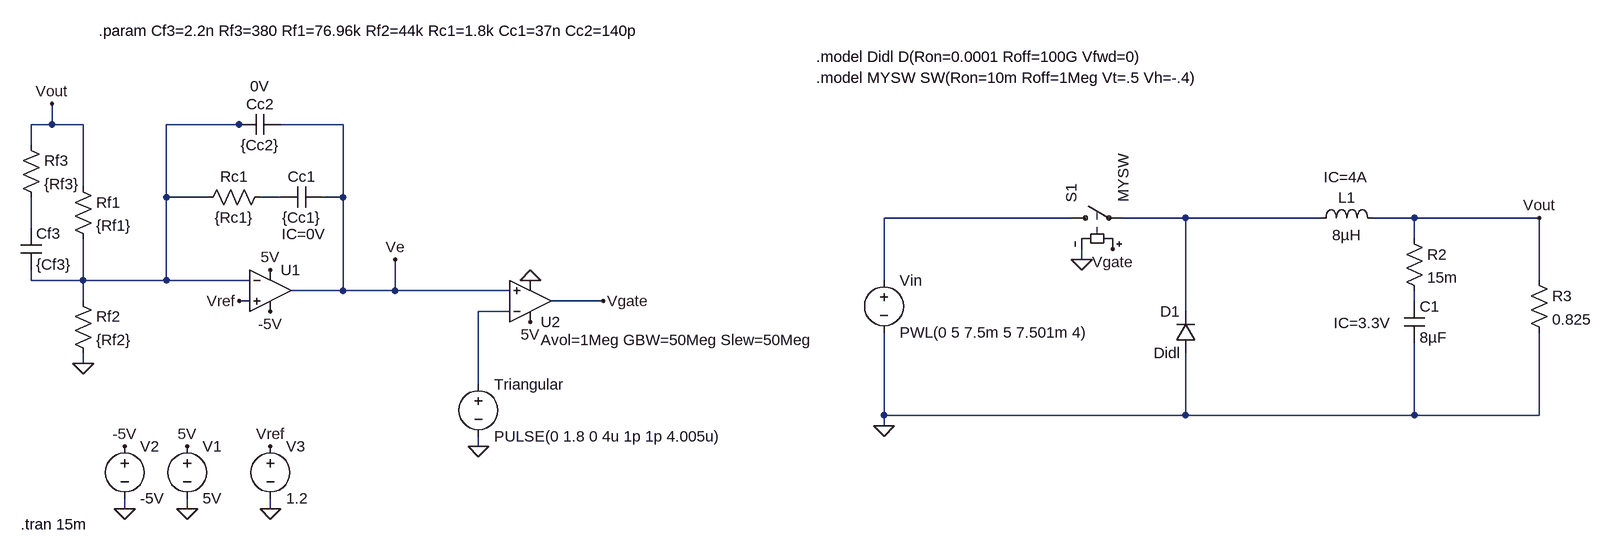
[diagram p0: schematic Q10_type_III_B.asc]
Q10_type_III_B.asc, the LTspice schematic file:
Version 4
SHEET 1 2636 680
WIRE -192 -304 -192 -336
WIRE -192 -304 -224 -304
WIRE -144 -304 -192 -304
WIRE 96 -304 -16 -304
WIRE 112 -304 96 -304
WIRE 256 -304 160 -304
WIRE -224 -272 -224 -304
WIRE -144 -208 -144 -304
WIRE -16 -192 -16 -304
WIRE 48 -192 -16 -192
WIRE 160 -192 128 -192
WIRE 256 -192 256 -304
WIRE 256 -192 224 -192
WIRE 1376 -160 1088 -160
WIRE 1552 -160 1456 -160
WIRE 1760 -160 1552 -160
WIRE 1904 -160 1840 -160
WIRE 2096 -160 1904 -160
WIRE -224 -144 -224 -192
WIRE 1904 -128 1904 -160
WIRE 1392 -96 1392 -112
WIRE -224 -64 -224 -80
WIRE -144 -64 -144 -128
WIRE -144 -64 -224 -64
WIRE -16 -64 -16 -192
WIRE -16 -64 -144 -64
WIRE 112 -64 -16 -64
WIRE 1088 -64 1088 -160
WIRE 2096 -64 2096 -160
WIRE 256 -48 256 -192
WIRE 256 -48 176 -48
WIRE 336 -48 336 -96
WIRE 336 -48 256 -48
WIRE 512 -48 336 -48
WIRE -144 -32 -144 -64
WIRE 112 -32 96 -32
WIRE 656 -32 576 -32
WIRE 1904 -32 1904 -48
WIRE 512 -16 464 -16
WIRE 1552 -16 1552 -160
WIRE -144 64 -144 48
WIRE 464 96 464 -16
WIRE 1088 144 1088 16
WIRE 1552 144 1552 48
WIRE 1552 144 1088 144
WIRE 1904 144 1904 32
WIRE 1904 144 1552 144
WIRE 2096 144 2096 16
WIRE 2096 144 1904 144
WIRE 1088 160 1088 144
WIRE 464 192 464 176
WIRE -80 288 -80 272
WIRE 16 288 16 272
WIRE 144 288 144 272
FLAG 16 288 0
FLAG -80 288 0
FLAG 16 192 5V
FLAG -80 192 -5V
FLAG 144 -80 5V
FLAG 144 288 0
FLAG 144 192 Vref
FLAG 96 -32 Vref
FLAG -144 64 0
FLAG -192 -336 Vout
FLAG 336 -96 Ve
FLAG 464 192 0
FLAG 544 0 5V
FLAG 656 -32 Vgate
FLAG 1088 160 0
FLAG 1392 -96 0
FLAG 1440 -112 Vgate
FLAG 2096 -160 Vout
FLAG 144 -16 -5V
FLAG 544 -64 0
SYMBOL voltage 16 176 R0
WINDOW 123 0 0 Left 0
WINDOW 39 0 0 Left 0
SYMATTR InstName V1
SYMATTR Value 5V
SYMBOL voltage -80 176 R0
WINDOW 123 0 0 Left 0
WINDOW 39 0 0 Left 0
SYMATTR InstName V2
SYMATTR Value -5V
SYMBOL OpAmps\\UniversalOpAmp2 144 -48 R0
SYMATTR InstName U1
SYMBOL res 144 -208 R90
WINDOW 0 0 56 VBottom 2
WINDOW 3 32 56 VTop 2
SYMATTR InstName Rc1
SYMATTR Value {Rc1}
SYMBOL cap 224 -208 R90
WINDOW 0 0 32 VBottom 2
WINDOW 3 32 32 VTop 2
WINDOW 39 88 29 VBottom 2
SYMATTR InstName Cc1
SYMATTR Value {Cc1}
SYMATTR SpiceLine IC=0V
SYMBOL cap 160 -320 R90
WINDOW 0 0 32 VBottom 2
WINDOW 3 32 32 VTop 2
WINDOW 39 -27 32 VBottom 2
SYMATTR InstName Cc2
SYMATTR Value {Cc2}
SYMATTR SpiceLine 0V
SYMBOL voltage 144 176 R0
WINDOW 123 0 0 Left 0
WINDOW 39 0 0 Left 0
SYMATTR InstName V3
SYMATTR Value 1.2
SYMBOL res -160 -48 R0
SYMATTR InstName Rf2
SYMATTR Value {Rf2}
SYMBOL cap -240 -144 R0
SYMATTR InstName Cf3
SYMATTR Value {Cf3}
SYMBOL res -240 -288 R0
SYMATTR InstName Rf3
SYMATTR Value {Rf3}
SYMBOL res -160 -224 R0
SYMATTR InstName Rf1
SYMATTR Value {Rf1}
SYMBOL voltage 464 80 R0
WINDOW 123 0 0 Left 0
WINDOW 39 0 0 Left 0
SYMATTR InstName Triangular
SYMATTR Value PULSE(0 1.8 0 4u 1p 1p 4.005u)
SYMBOL OpAmps\\UniversalOpAmp2 544 -32 M180
WINDOW 123 16 -60 Left 2
SYMATTR Value2 Avol=1Meg GBW=50Meg Slew=50Meg
SYMATTR InstName U2
SYMBOL voltage 1088 -80 R0
WINDOW 123 0 0 Left 0
WINDOW 39 0 0 Left 0
SYMATTR InstName Vin
SYMATTR Value PWL(0 5 7.5m 5 7.501m 4)
SYMBOL sw 1360 -160 R270
SYMATTR InstName S1
SYMATTR Value MYSW
SYMBOL diode 1568 48 R180
WINDOW 0 24 64 Left 2
WINDOW 3 24 0 Left 2
SYMATTR InstName D1
SYMATTR Value Didl
SYMBOL ind 1744 -144 R270
WINDOW 0 32 56 VTop 2
WINDOW 3 5 56 VBottom 2
WINDOW 39 63 54 VTop 2
SYMATTR InstName L1
SYMATTR Value 8µH
SYMATTR SpiceLine IC=4A
SYMBOL res 1888 -144 R0
SYMATTR InstName R2
SYMATTR Value 15m
SYMBOL cap 1888 -32 R0
WINDOW 39 -108 34 Left 2
SYMATTR SpiceLine IC=3.3V
SYMATTR InstName C1
SYMATTR Value 8µF
SYMBOL res 2080 -80 R0
SYMATTR InstName R3
SYMATTR Value 0.825
TEXT -120 -448 Left 2 !.param Cf3=2.2n Rf3=380 Rf1=76.96k Rf2=44k Rc1=1.8k Cc1=37n Cc2=140p
TEXT 984 -376 Left 2 !.model MYSW SW(Ron=10m Roff=1Meg Vt=.5 Vh=-.4)
TEXT 984 -408 Left 2 !.model Didl D(Ron=0.0001 Roff=100G Vfwd=0)
TEXT -240 312 Left 2 !.tran 15m

The netlist it stands for:
* Q10_type_III_B.asc
V1 5V 0 5V
V2 -5V 0 -5V
XU1 Vref N001 5V -5V Ve level2 Avol=1Meg GBW=10Meg Slew=10Meg Ilimit=25m Rail=0 Vos=0 En=0 Enk=0 In=0 Ink=0 Rin=500Meg  ; pins In+ In- V+ V- OUT
Rc1 N002 N001 {Rc1}
Cc1 Ve N002 {Cc1} IC=0V
Cc2 Ve N001 {Cc2} 0V
V3 Vref 0 1.2
Rf2 N001 0 {Rf2}
Cf3 N005 N001 {Cf3}
Rf3 Vout N005 {Rf3}
Rf1 Vout N001 {Rf1}
V§Triangular N007 0 PULSE(0 1.8 0 4u 1p 1p 4.005u)
XU2 Ve N007 5V 0 Vgate level2 Avol=1Meg GBW=50Meg Slew=50Meg Ilimit=25m Rail=0 Vos=0 En=0 Enk=0 In=0 Ink=0 Rin=500Meg  ; pins In+ In- V+ V- OUT
Vin N003 0 PWL(0 5 7.5m 5 7.501m 4)
S1 N003 N004 Vgate 0 MYSW
D1 0 N004 Didl
L1 N004 Vout 8µH IC=4A
R2 Vout N006 15m
C1 N006 0 8µF IC=3.3V
R3 Vout 0 0.825
.model D D
.lib standard.dio
.param Cf3=2.2n Rf3=380 Rf1=76.96k Rf2=44k Rc1=1.8k Cc1=37n Cc2=140p
.model MYSW SW(Ron=10m Roff=1Meg Vt=.5 Vh=-.4)
.model Didl D(Ron=0.0001 Roff=100G Vfwd=0)
.tran 15m
.lib UniversalOpAmp2.lib
.backanno
.end